# Altium schematic sheet Photodiode.SchDoc
size 420 x 297 mm; Address1: Address1; Address2: Address2; Address3: Address3; Address4: Address4; DocumentNumber: *Э3; SheetNumber: 2; SheetTotal: 15; DocumentType: Схема электрическая *
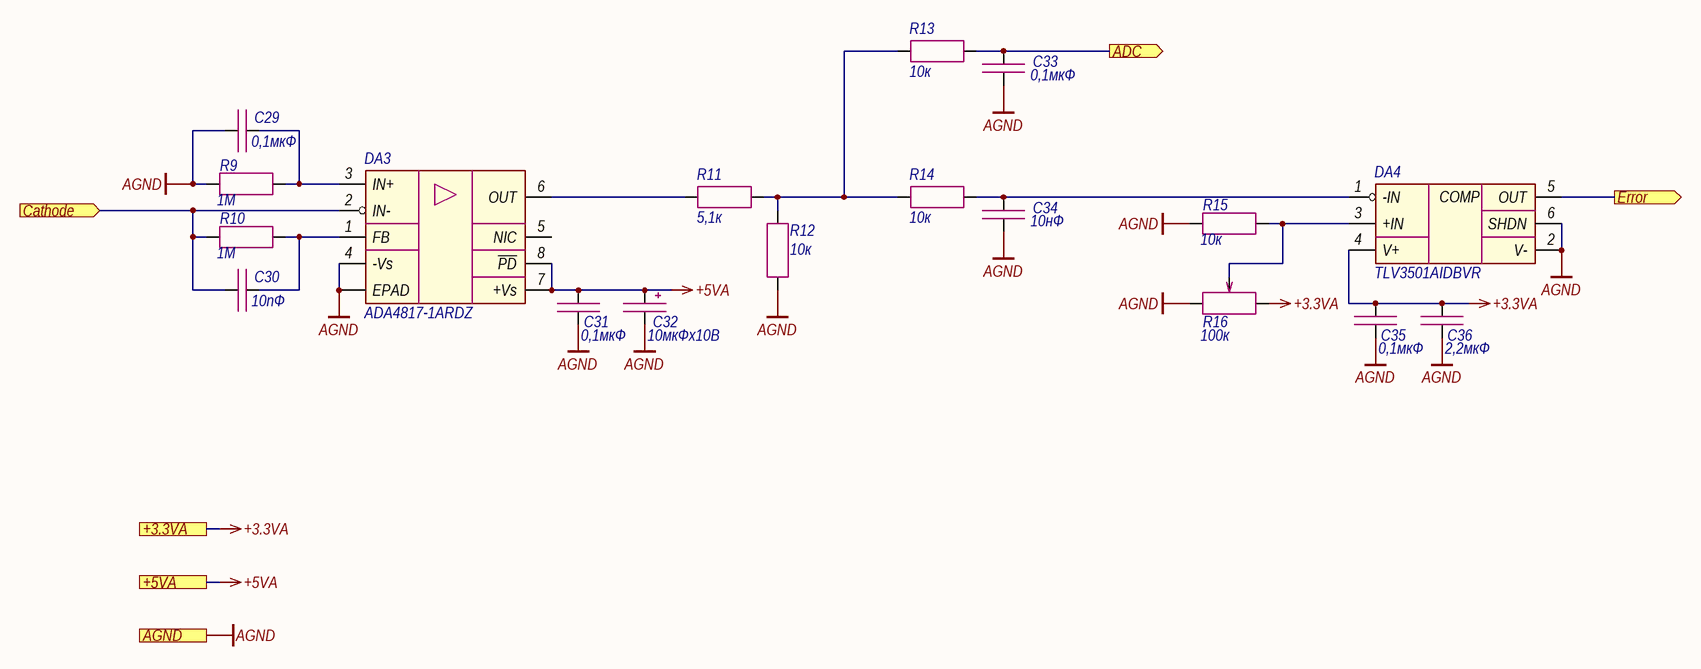
[diagram p0: Photodiode.SchDoc]

## Parts
C29  0,1мкФ  [CAP_0603]
C30  10пФ  [CAP_0603]
C31  0,1мкФ  [CAP_0603]
C32  10мкФх10B  [CAP_A]
C33  0,1мкФ  [CAP_0603]
C34  10нФ  [CAP_0603]
C35  0,1мкФ  [CAP_0603]
C36  2,2мкФ  [CAP_0603]
DA3  ADA4817-1ARDZ  [SOIC-8 EPAD]
DA4  TLV3501AIDBVR  [SOT-23-6]
R9  1М  [RES_0805]
R10  1М  [RES_0805]
R11  5,1к  [RES_0603]
R12  10к  [RES_0603]
R13  10к  [RES_0603]
R14  10к  [RES_0603]
R15  10к  [RES_0603]
R16  100к  [3224W]

## Ports
+3.3VA (see Main[2A], Hardwiring[4D], Thermistor[2C]), +5VA (see Main[1A]), ADC (out, see Main[2A]), AGND (see Main[1A], Hardwiring[4D], Thermistor[2C]), Cathode (in, see Main[1A]), Error (out, see Main[2A])

## Nets
+3.3VA: C35.1 C36.1 DA4.4(V+) R16.3 ; port +3.3VA
+5VA: C31.1 C32.1 DA3.7(+Vs) DA3.8(~{PD}) ; port +5VA
AGND: C29.1 C31.2 C32.2 C33.2 C34.2 C35.2 C36.2 DA3.4(-Vs) DA3.EPAD DA4.2(V-) DA4.6(SHDN) R9.2 R12.2 R15.1 R16.1 ; port AGND
ADC: C33.1 R13.2 ; port ADC
Cathode: C30.2 DA3.2(IN-) R10.2 ; port Cathode
Error: DA4.5(OUT) ; port Error
NetC29_2: C29.2 DA3.3(IN+) R9.1
NetC30_1: C30.1 DA3.1(FB) R10.1
NetC34_1: C34.1 DA4.1(-IN) R14.2
NetDA3_6: DA3.6(OUT) R11.1
NetDA4_3: DA4.3(+IN) R15.2 R16.2
NetR11_2: R11.2 R12.1 R13.1 R14.1

Not connected (* = marked no-connect by the designer): DA3 5(NIC)

## Notes on the sheet
- Подп. и дата
- Инв. № дубл.
- Взам. инв. №
- Инв. № подл.
- Изм.
- Лист
- № докум.
- Подп.
- Дата
- Копировал
- Формат А3
- (in symbol TLV3501) COMP

## Library data of the parts
C29 C31 C33 C35 = Capacitor: Manufacturer: Murata; Model: GRM188R71H104KA93D; Value: 0,1мкФ; Document: *
C30 = Capacitor: Manufacturer: Murata; Model: GRM1885C1H100JA01D; Value: 10пФ; Document: *
C32 = Capacitor_Polar: Model: TECAP, 10 мкФ, 10 В, тип A, 10%; Value: 10мкФх10B; Document: *; Manufacturer: *
C34 = Capacitor: Manufacturer: Murata; Model: GRM188R71H103JA01D; Value: 10нФ; Document: *
C36 = Capacitor: Manufacturer: Murata; Model: GRM188R61H225KE11D; Value: 2,2мкФ; Document: *
DA3 = ADA4817-1ARDZ: Manufacturer: Analog Devices; Model: ADA4817-1ARDZ; Document: *
DA4 = TLV3501: Manufacturer: Texas Instruments; Model: TLV3501AIDBVR; Document: *
R9 R10 = Resistor: Manufacturer: Yageo; Model: RC0805FR-071ML; Value: 1М; Document: *
R11 = Resistor: Manufacturer: Yageo; Model: RC0603FR-075K1L; Value: 5,1к; Document: *
R12-R15 = Resistor: Manufacturer: Yageo; Model: RC0603FR-0710KL; Value: 10к; Document: *
R16 = Resistor_Variable: Manufacturer: Bourns; Model: 3224W-1-104E; Value: 100к; Document: *